# Altium schematic sheet F1C200S.SchDoc
size A2
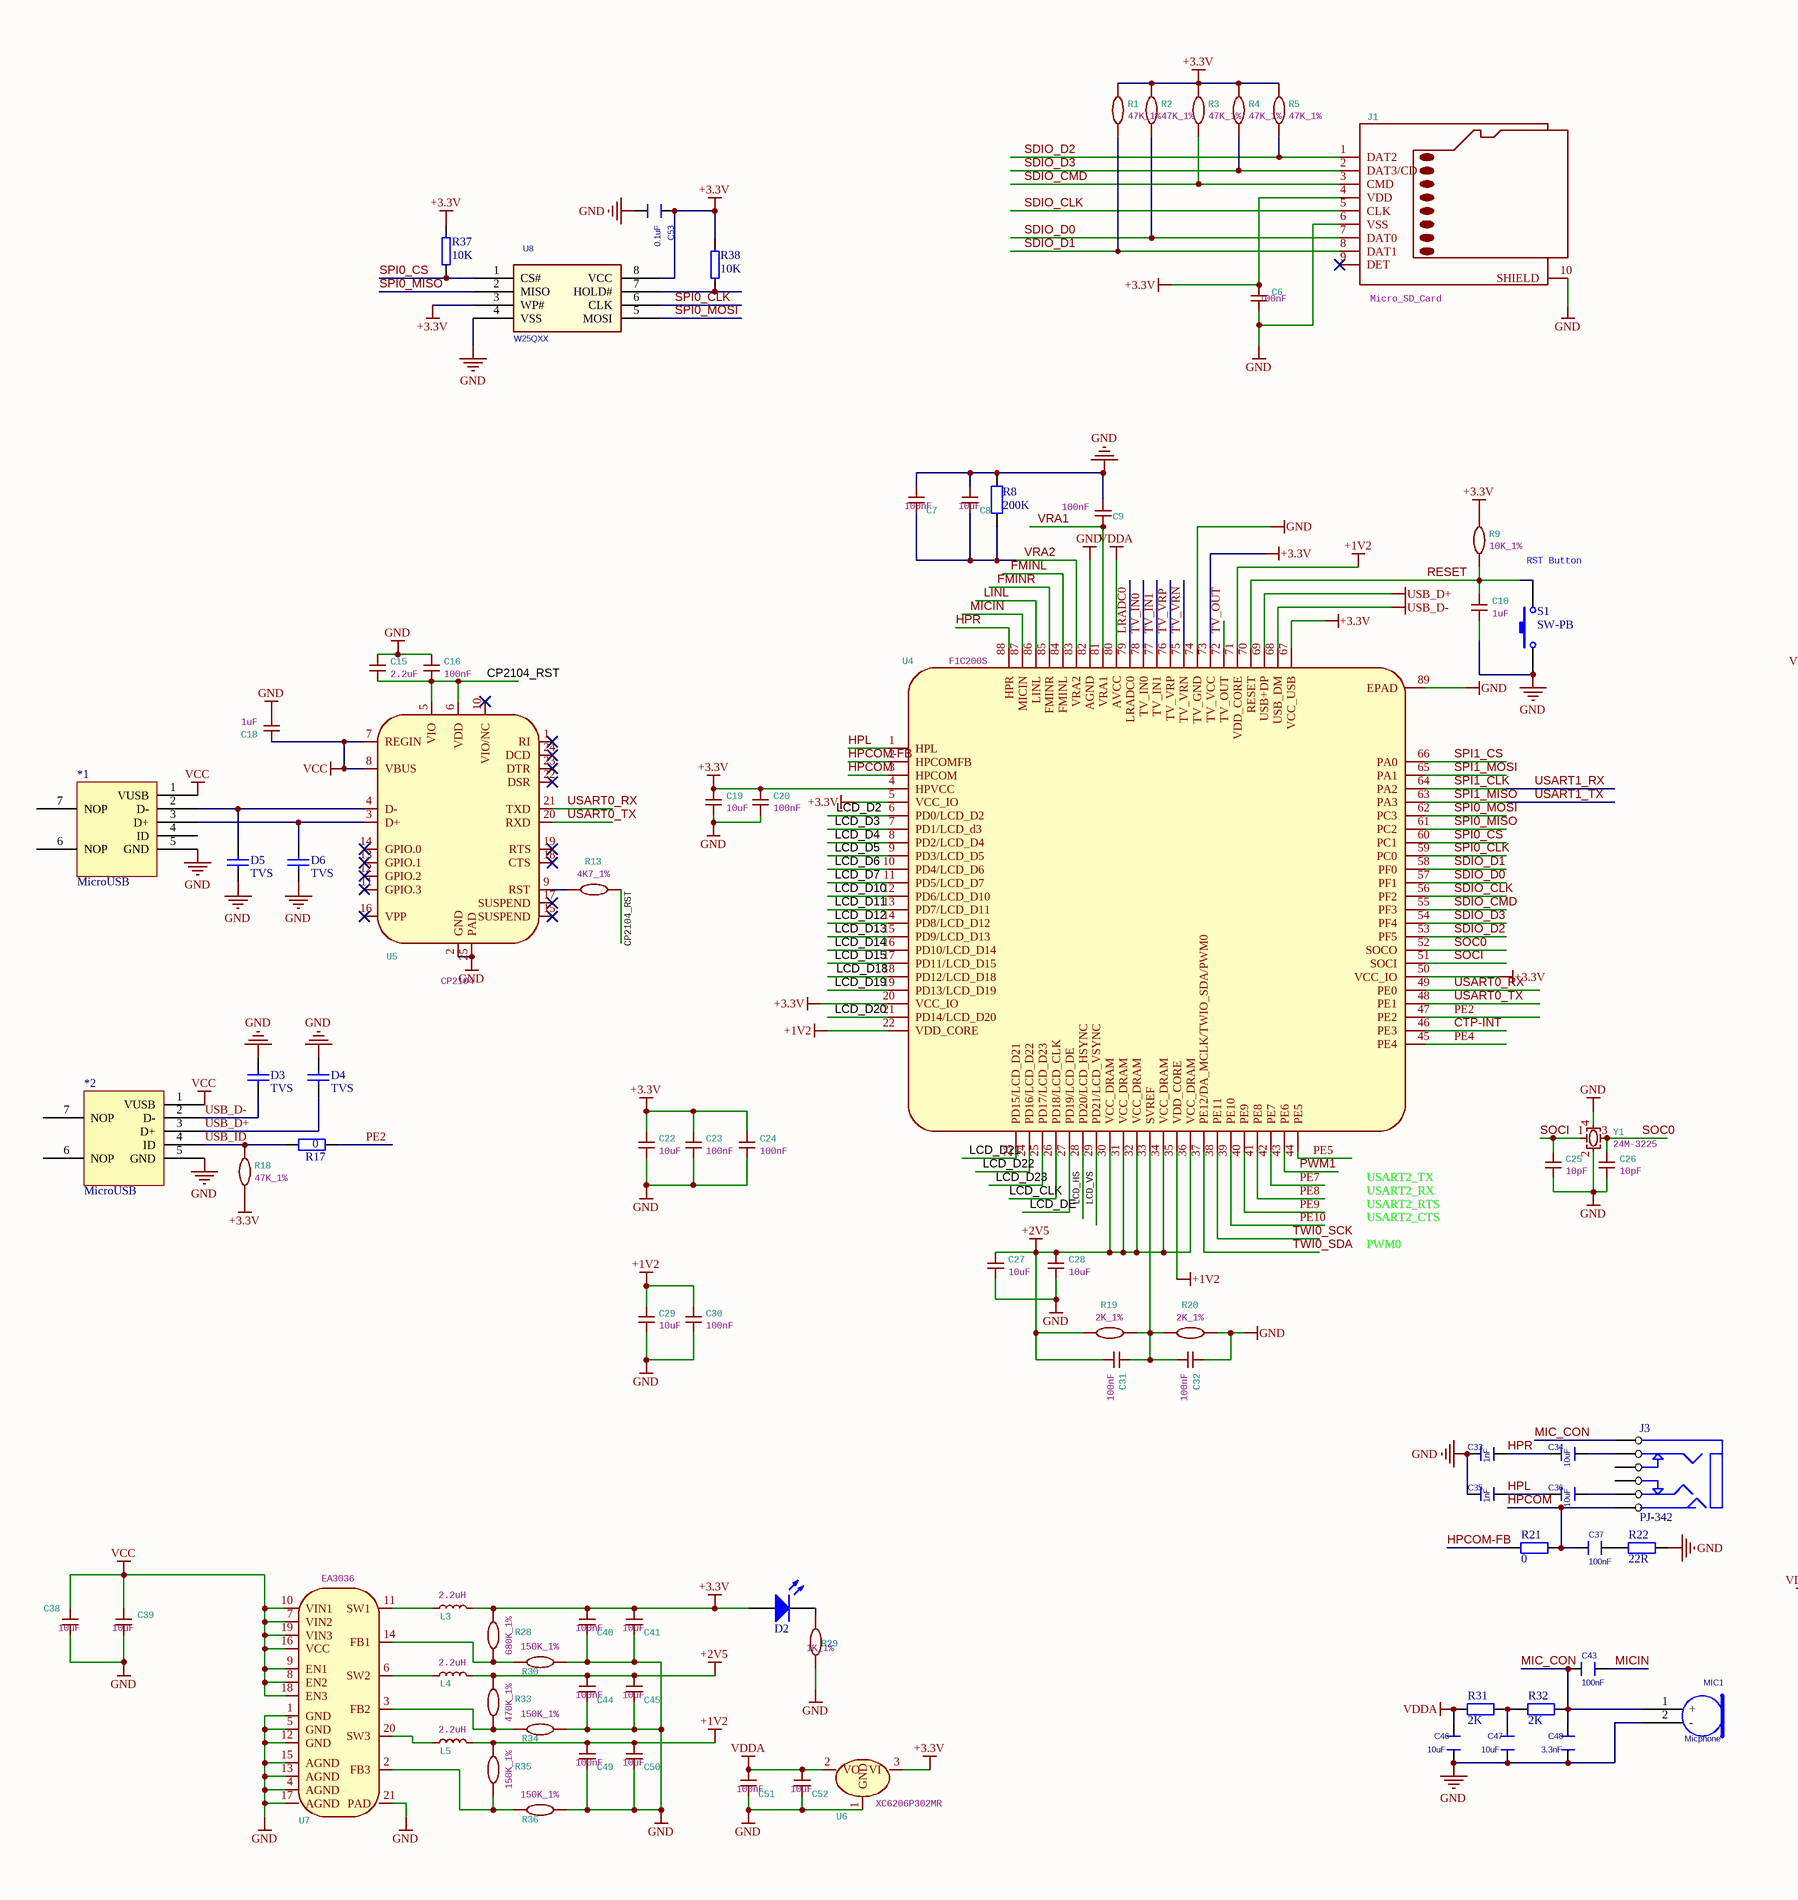
[diagram p0: F1C200S.SchDoc, left]
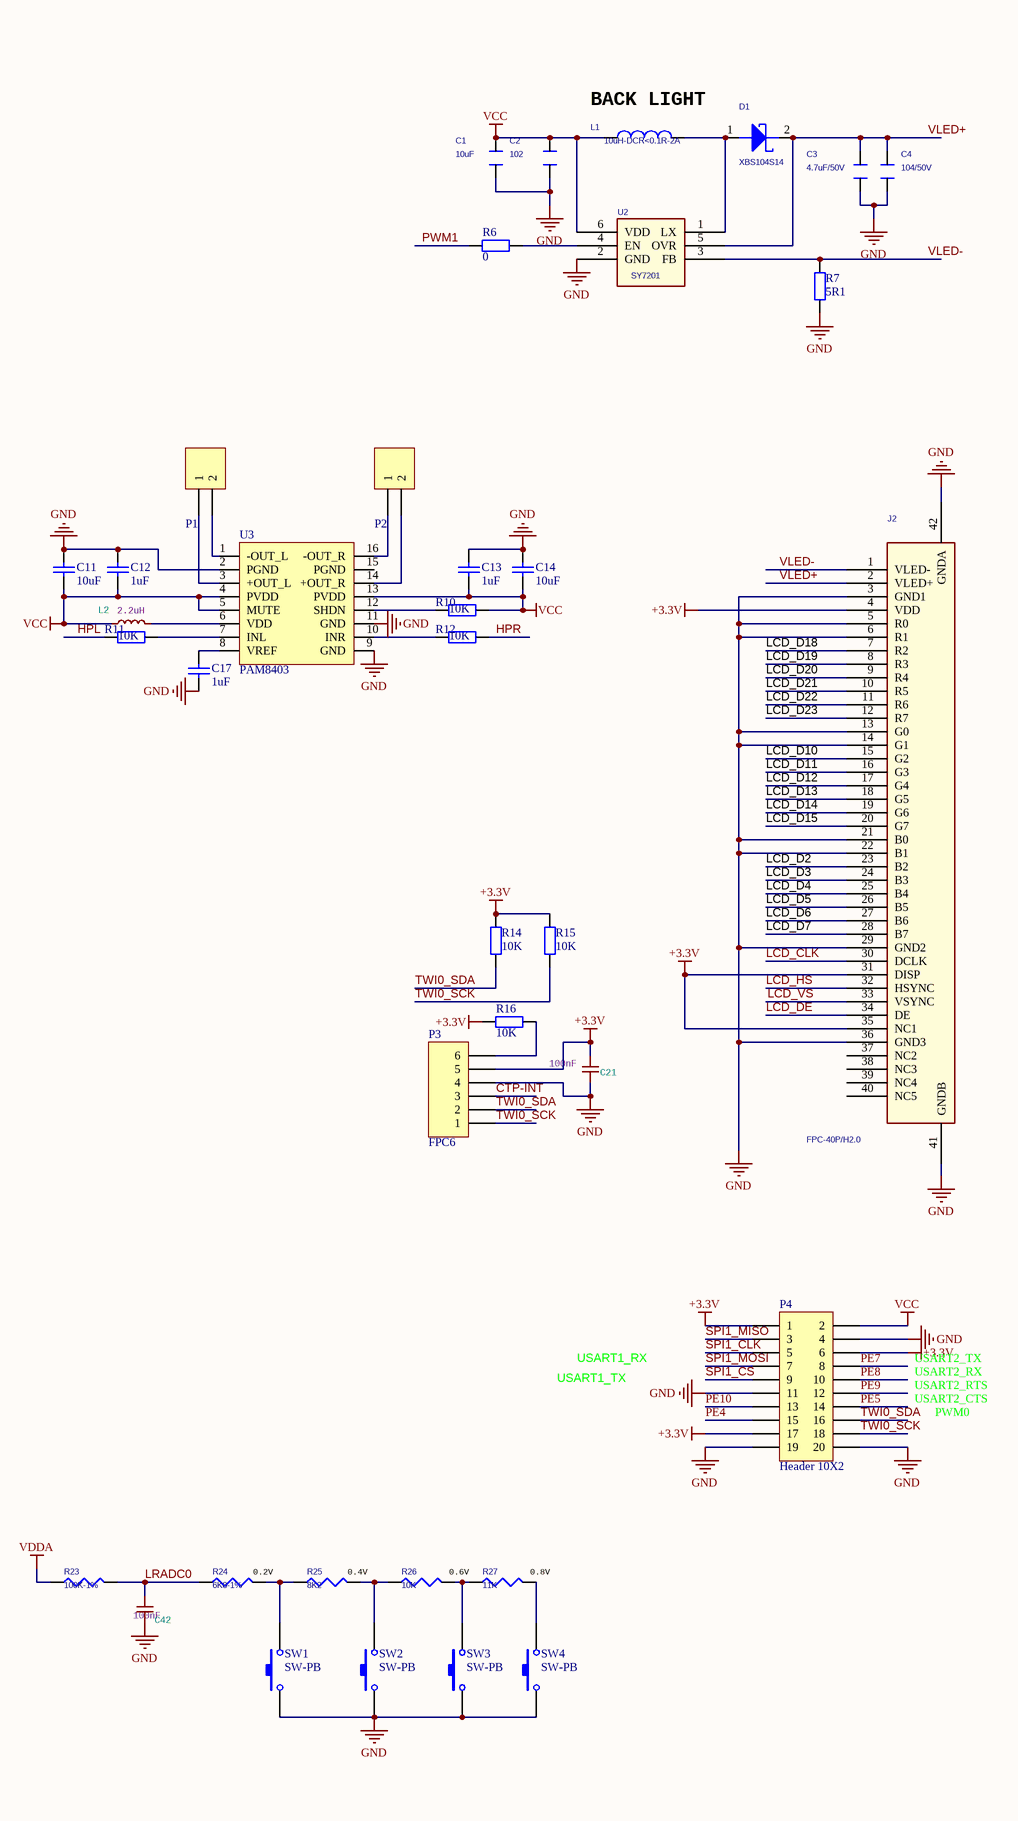
[diagram p1: F1C200S.SchDoc, right]

## Parts
*1  MicroUSB  [USB_Micro - 4FP]
*2  MicroUSB  [USB_Micro - 4FP]
C1  10uF  [C0603]
C2  102  [C0603]
C3  4.7uF/50V  [C0603]
C4  104/50V  [C0603]
C6  03.0009_C0402_100nF  [C0402]  (value not drawn)
C7  03.0009_C0402_100nF  [C0402]  (value not drawn)
C8  03.4004_C0603_10uF  [C0603]  (value not drawn)
C9  03.0009_C0402_100nF  [C0402]  (value not drawn)
C10  03.0001_C0402_1uF  [C0402]  (value not drawn)
C11  value 10uF  [C0603]  (hidden comment: Cap)
C12  value 1uF  [C0402]  (hidden comment: Cap)
C13  value 1uF  [C0402]  (hidden comment: Cap)
C14  value 10uF  [C0603]  (hidden comment: Cap)
C15  03.4002_C0603_2.2uF  [C0402]  (value not drawn)
C16  03.0009_C0402_100nF  [C0402]  (value not drawn)
C17  value 1uF  [C0402]  (hidden comment: Cap)
C18  03.4001_C0603_1uF  [C0402]  (value not drawn)
C19  03.4004_C0603_10uF  [C0603]  (value not drawn)
C20  03.0009_C0402_100nF  [C0402]  (value not drawn)
C21  03.0009_C0402_100nF  [C0402]  (value not drawn)
C22  03.4004_C0603_10uF  [C0603]  (value not drawn)
C23  03.0009_C0402_100nF  [C0402]  (value not drawn)
C24  03.0009_C0402_100nF  [C0402]  (value not drawn)
C25  03.0003_C0402_10pF  [C0402]  (value not drawn)
C26  03.0003_C0402_10pF  [C0402]  (value not drawn)
C27  03.4004_C0603_10uF  [C0603]  (value not drawn)
C28  03.4004_C0603_10uF  [C0603]  (value not drawn)
C29  03.4004_C0603_10uF  [C0603]  (value not drawn)
C30  03.0009_C0402_100nF  [C0402]  (value not drawn)
C31  03.0009_C0402_100nF  [C0402]  (value not drawn)
C32  03.0009_C0402_100nF  [C0402]  (value not drawn)
C33  1nF  [C0402]
C34  10uF  [C0603]
C35  1nF  [C0402]
C36  10uF  [C0603]
C37  100nF  [C0402]
C38  03.4004_C0603_10uF  [C0603]  (value not drawn)
C39  03.4004_C0603_10uF  [C0603]  (value not drawn)
C40  03.0009_C0402_100nF  [C0402]  (value not drawn)
C41  03.4004_C0603_10uF  [C0603]  (value not drawn)
C42  03.0009_C0402_100nF  [C0402]  (value not drawn)
C43  100nF  [C0402]
C44  03.0009_C0402_100nF  [C0402]  (value not drawn)
C45  03.4004_C0603_10uF  [C0603]  (value not drawn)
C46  10uF  [C0603]
C47  10uF  [C0603]
C48  3.3nF  [C0402]
C49  03.0009_C0402_100nF  [C0402]  (value not drawn)
C50  03.4004_C0603_10uF  [C0603]  (value not drawn)
C51  03.0009_C0402_100nF  [C0402]  (value not drawn)
C52  03.4004_C0603_10uF  [C0603]  (value not drawn)
C53  0.1uF  [C0402]
D1  XBS104S14  [SOD123]
D2  LED0  [0603LED]  (value not drawn)
D3  value TVS  [C0402]  (hidden comment: Cap)
D4  value TVS  [C0402]  (hidden comment: Cap)
D5  value TVS  [C0402]  (hidden comment: Cap)
D6  value TVS  [C0402]  (hidden comment: Cap)
J1  10.0001_Micro_SD_Card  [SDCARD-M]  (value not drawn)
J2  FPC-40P/H2.0  [FPC0.5-40P-B]
J3  PJ-342  [PJ-342]
L1  10uH-DCR<0.1R-2A  [3015]
L2  06.0102_L2520_2.2uH  [3015]  (value not drawn)
L3  06.0102_L2520_2.2uH  [3015]  (value not drawn)
L4  06.0102_L2520_2.2uH  [3015]  (value not drawn)
L5  06.0102_L2520_2.2uH  [3015]  (value not drawn)
MIC1  Micphone  [MIC_6022]
P1  Header 2  [HDR2X1_A]  (value not drawn)
P2  Header 2  [HDR2X1_A]  (value not drawn)
P3  FPC6  [FPC0.5-6P-A]
P4  Header 10X2  [HDR2X10]
R1  02.0014_R0402_10K_1%  [R0402]  (value not drawn)
R2  02.0014_R0402_10K_1%  [R0402]  (value not drawn)
R3  02.0014_R0402_10K_1%  [R0402]  (value not drawn)
R4  02.0014_R0402_10K_1%  [R0402]  (value not drawn)
R5  02.0014_R0402_10K_1%  [R0402]  (value not drawn)
R6  value 0  [R0402]  (hidden comment: Res1)
R7  value 5R1  [R0603]  (hidden comment: Res1)
R8  value 200K  [R0402]  (hidden comment: Res1)
R9  02.0008_R0402_10K_1%  [R0402]  (value not drawn)
R10  value 10K  [R0402]  (hidden comment: Res1)
R11  value 10K  [R0402]  (hidden comment: Res1)
R12  value 10K  [R0402]  (hidden comment: Res1)
R13  02.0005_R0402_4K7_1%  [R0402]  (value not drawn)
R14  value 10K  [R0402]  (hidden comment: Res1)
R15  value 10K  [R0402]  (hidden comment: Res1)
R16  value 10K  [R0402]  (hidden comment: Res1)
R17  value 0  [R0402]  (hidden comment: Res1)
R18  02.0014_R0402_10K_1%  [R0402]  (value not drawn)
R19  02.0026_R0402_2K_1%  [R0402]  (value not drawn)
R20  02.0026_R0402_2K_1%  [R0402]  (value not drawn)
R21  value 0  [R0402]  (hidden comment: Res1)
R22  value 22R  [R0603]  (hidden comment: Res1)
R23  100K-1%  [R0402]
R24  6K8-1%  [R0402]
R25  8K2  [R0402]
R26  10K  [R0402]
R27  11K  [R0402]
R28  02.0025_R0402_680K_1%  [R0402]  (value not drawn)
R29  02.0003_R0402_1K_1%  [R0402]  (value not drawn)
R30  02.0023_R0402_150K_1%  [R0402]  (value not drawn)
R31  value 2K  [R0402]  (hidden comment: Res1)
R32  value 2K  [R0402]  (hidden comment: Res1)
R33  02.0024_R0402_470K_1%  [R0402]  (value not drawn)
R34  02.0023_R0402_150K_1%  [R0402]  (value not drawn)
R35  02.0023_R0402_150K_1%  [R0402]  (value not drawn)
R36  02.0023_R0402_150K_1%  [R0402]  (value not drawn)
R37  10K  [R0402]
R38  10K  [R0402]
S1  SW-PB  [SW_PB4_3*4*2.5]
SW1  SW-PB  [SW_PB4_3*4*2.5]
SW2  SW-PB  [SW_PB4_3*4*2.5]
SW3  SW-PB  [SW_PB4_3*4*2.5]
SW4  SW-PB  [SW_PB4_3*4*2.5]
U2  SY7201  [SOT-23-6]
U3  PAM8403  [SOP-16]
U4  08.0001_F1C200S  [QFN-88_EP_10X10_PITCH0.4MM]  (value not drawn)
U5  09.0001_CP2104  [QFN-24-1EP_4X4MM_P0.5MM_EP2.6X2.6MM]  (value not drawn)
U6  09.0103_XC6206  [SOT-23]  (value not drawn)
U7  09.0102_EA3036  [QFN-20_EP_3X3_PITCH0.4MM]  (value not drawn)
U8  W25QXX  [SOP-8M(PAD)]
Y1  07.0403_Crystal_24M_3225  [CRYSTAL-2.5X2.0]  (value not drawn)

## Nets
+1V2: C29.1 C30.1 C49.1 C50.1 L5.1 R35.2 U4.22(VDD_CORE) U4.35(VDD_CORE) U4.71(VDD_CORE)
+2V5: C27.1 C28.1 C31.2 C44.1 C45.1 L4.1 R19.2 R33.2 U4.30(VCC_DRAM) U4.31(VCC_DRAM) U4.32(VCC_DRAM) U4.34(VCC_DRAM) U4.36(VCC_DRAM)
+3.3V: C6.1 C19.1 C20.1 C21.2 C22.1 C23.1 C24.1 C40.1 C41.1 C53.2 D2.1(A) J1.4(VDD) J2.4(VDD) J2.31(DISP) J2.35(NC1) L3.1 P3.5 P4.1 P4.6 P4.17 R1.1 R2.1 R3.1 R4.1 R5.1 R9.1 R14.2 R15.2 R16.2 R18.2 R28.2 R37.1 R38.1 U4.4(HPVCC) U4.5(VCC_IO) U4.20(VCC_IO) U4.50(VCC_IO) U4.67(VCC_USB) U4.73(TV_VCC) U6.3(VI) U8.3(WP#) U8.8(VCC)
GND: *1.5(GND) *2.5(GND) C1.1 C2.1 C3.1 C4.1 C6.2 C7.1 C8.1 C9.2 C10.2 C11.1 C12.1 C13.1 C14.1 C15.1 C16.1 C17.2 C18.2 C19.2 C20.2 C21.1 C22.2 C23.2 C24.2 C25.2 C26.2 C27.2 C28.2 C29.2 C30.2 C32.1 C33.1 C35.1 C38.2 C39.2 C40.2 C41.2 C42.2 C44.2 C45.2 C46.2 C47.2 C48.2 C49.2 C50.2 C51.2 C52.2 C53.1 D3.2 D4.2 D5.1 D6.1 J1.6(VSS) J1.10(SHIELD) J2.3(GND1) J2.5(R0) J2.6(R1) J2.13(G0) J2.14(G1) J2.21(B0) J2.22(B1) J2.29(GND2) J2.36(GND3) J2.41(GNDB) J2.42(GNDA) MIC1.2(-) P3.4 P4.4 P4.11 P4.19 P4.20 R7.2 R8.2 R20.1 R22.1 R29.2 R30.1 R34.1 R36.1 S1.1 SW1.1 SW2.1 SW3.1 SW4.1 U2.2(GND) U3.2(PGND) U3.9(GND) U3.11(GND) U4.74(TV_GND) U4.82(AGND) U4.89(EPAD) U5.2(GND) U5.25(PAD) U6.1(GND) U7.1(GND) U7.4(AGND) U7.5(GND) U7.12(GND) U7.13(AGND) U7.15(AGND) U7.17(AGND) U7.21(PAD) U8.4(VSS) Y1.2 Y1.4
USB_D+: *2.3(D+) D4.1 U4.69(USB+DP)
USB_D-: *2.2(D-) D3.1 U4.68(USB_DM)
VCC: *1.1(VUSB) *2.1(VUSB) C1.2 C2.2 C11.2 C12.2 C13.2 C14.2 C18.1 C38.1 C39.1 L1.1 L2.2 P4.2 R10.2 U2.6(VDD) U3.4(PVDD) U3.5(MUTE) U3.13(PVDD) U5.7(REGIN) U5.8(VBUS) U7.7(VIN2) U7.8(EN2) U7.9(EN1) U7.10(VIN1) U7.16(VCC) U7.18(EN3) U7.19(VIN3)
VDDA: C46.1 C51.1 C52.1 R23.1 R31.2 U4.80(AVCC) U6.2(VO)
CP2104_RST: C15.2 C16.2 R13.2 U5.5(VIO) U5.6(VDD)
CTP-INT: P3.3 U4.46(PE3)
FMINL: U4.84(FMINL)
FMINR: U4.85(FMINR)
HPCOM: C37.2 J3.3(GND) R21.1 U4.3(HPCOM)
HPCOM-FB: R21.2 U4.2(HPCOMFB)
HPL: C35.2 C36.1 R11.2 U4.1(HPL)
HPR: C33.2 C34.1 R12.2 U4.88(HPR)
LCD_CLK: J2.30(DCLK) U4.26(PD18/LCD_CLK)
LCD_D2: J2.23(B2) U4.6(PD0/LCD_D2)
LCD_D3: J2.24(B3) U4.7(PD1/LCD_d3)
LCD_D4: J2.25(B4) U4.8(PD2/LCD_D4)
LCD_D5: J2.26(B5) U4.9(PD3/LCD_D5)
LCD_D6: J2.27(B6) U4.10(PD4/LCD_D6)
LCD_D7: J2.28(B7) U4.11(PD5/LCD_D7)
LCD_D10: J2.15(G2) U4.12(PD6/LCD_D10)
LCD_D11: J2.16(G3) U4.13(PD7/LCD_D11)
LCD_D12: J2.17(G4) U4.14(PD8/LCD_D12)
LCD_D13: J2.18(G5) U4.15(PD9/LCD_D13)
LCD_D14: J2.19(G6) U4.16(PD10/LCD_D14)
LCD_D15: J2.20(G7) U4.17(PD11/LCD_D15)
LCD_D18: J2.7(R2) U4.18(PD12/LCD_D18)
LCD_D19: J2.8(R3) U4.19(PD13/LCD_D19)
LCD_D20: J2.9(R4) U4.21(PD14/LCD_D20)
LCD_D21: J2.10(R5) U4.23(PD15/LCD_D21)
LCD_D22: J2.11(R6) U4.24(PD16/LCD_D22)
LCD_D23: J2.12(R7) U4.25(PD17/LCD_D23)
LCD_DE: J2.34(DE) U4.27(PD19/LCD_DE)
LCD_HS: J2.32(HSYNC) U4.28(PD20/LCD_HSYNC)
LCD_VS: J2.33(VSYNC) U4.29(PD21/LCD_VSYNC)
LINL: U4.86(LINL)
LRADC0: C42.1 R23.2 R24.1 U4.79(LRADC0)
MIC_CON: C43.2 C48.1 J3.2(MIC) MIC1.1(+) R32.1
MICIN: C43.1 U4.87(MICIN)
PE2: R17.2 U4.47(PE2)
PE4: P4.15 U4.45(PE4)
PE5: P4.14 U4.44(PE5)
PE7: P4.8 U4.42(PE7)
PE8: P4.10 U4.41(PE8)
PE9: P4.12 U4.40(PE9)
PE10: P4.13 U4.39(PE10)
PWM1: R6.1 U4.43(PE6)
RESET: C10.1 R9.2 S1.2 U4.70(RESET)
SDIO_CLK: J1.5(CLK) U4.56(PF2)
SDIO_CMD: J1.3(CMD) R3.2 U4.55(PF3)
SDIO_D0: J1.7(DAT0) R2.2 U4.57(PF1)
SDIO_D1: J1.8(DAT1) R1.2 U4.58(PF0)
SDIO_D2: J1.1(DAT2) R5.2 U4.53(PF5)
SDIO_D3: J1.2(DAT3/CD) R4.2 U4.54(PF4)
SOC0: C26.1 U4.52(SOCO) Y1.3
SOCI: C25.1 U4.51(SOCI) Y1.1
SPI0_CLK: U4.59(PC0) U8.6(CLK)
SPI0_CS: R37.2 U4.60(PC1) U8.1(CS#)
SPI0_MISO: U4.61(PC2) U8.2(MISO)
SPI0_MOSI: U4.62(PC3) U8.5(MOSI)
SPI1_CLK: P4.5 U4.64(PA2)  [also labelled USART1_RX]
SPI1_CS: P4.9 U4.66(PA0)
SPI1_MISO: P4.3 U4.63(PA3)  [also labelled USART1_TX]
SPI1_MOSI: P4.7 U4.65(PA1)
TV_IN0: U4.78(TV_IN0)
TV_IN1: U4.77(TV_IN1)
TV_OUT: U4.72(TV_OUT)
TV_VRN: U4.75(TV_VRN)
TV_VRP: U4.76(TV_VRP)
TWI0_SCK: P3.1 P4.18 R15.1 U4.38(PE11)
TWI0_SDA: P3.2 P4.16 R14.1 U4.37(PE12/DA_MCLK/TWIO_SDA/PWM0)
USART0_RX: U4.49(PE0) U5.21(TXD)
USART0_TX: U4.48(PE1) U5.20(RXD)
USB_ID: *2.4(ID) R17.1 R18.1
VLED+: C3.2 C4.2 D1.2 J2.2(VLED+) U2.5(OVR)
VLED-: J2.1(VLED-) R7.1 U2.3(FB)
VRA1: C9.1 U4.81(VRA1)
VRA2: C7.2 C8.2 R8.1 U4.83(VRA2)
Net*1_2: *1.2(D-) D5.2 U5.4(D-)
Net*1_3: *1.3(D+) D6.2 U5.3(D+)
NetC17_1: C17.1 U3.8(VREF)
NetC31_1: C31.1 C32.2 R19.1 R20.2 U4.33(SVREF)
NetC34_2: C34.2 J3.4(R)
NetC36_2: C36.2 J3.6(L)
NetC37_1: C37.1 R22.2
NetC47_1: C47.1 R31.1 R32.2
NetD1_1: D1.1 L1.2 U2.1(LX)
NetD2_2: D2.2(K) R29.1
NetL2_1: L2.1 U3.6(VDD)
NetL3_2: L3.2 U7.11(SW1)
NetL4_2: L4.2 U7.6(SW2)
NetL5_2: L5.2 U7.20(SW3)
NetP1_1: P1.1 U3.3(+OUT_L)
NetP1_2: P1.2 U3.1(-OUT_L)
NetP2_1: P2.1 U3.16(-OUT_R)
NetP2_2: P2.2 U3.14(+OUT_R)
NetP3_6: P3.6 R16.1
NetR6_2: R6.2 U2.4(EN)
NetR10_1: R10.1 U3.12(SHDN)
NetR11_1: R11.1 U3.7(INL)
NetR12_1: R12.1 U3.10(INR)
NetR13_1: R13.1 U5.9(RST)
NetR24_2: R24.2 R25.1 SW1.2
NetR25_2: R25.2 R26.1 SW2.2
NetR26_2: R26.2 R27.1 SW3.2
NetR27_2: R27.2 SW4.2
NetR28_1: R28.1 R30.2 U7.14(FB1)
NetR33_1: R33.1 R34.2 U7.3(FB2)
NetR35_1: R35.1 R36.2 U7.2(FB3)
NetR38_2: R38.2 U8.7(HOLD#)

Not connected (* = marked no-connect by the designer): *1 4(ID) 6(NOP) 7(NOP); *2 6(NOP) 7(NOP); J1 9(DET)*; J2 37(NC2) 38(NC3) 39(NC4) 40(NC5); J3 5(R_DET) 7(L_DET); U3 15(PGND); U5 1(RI)* 10(VIO/NC)* 11(GPIO.3)* 12(GPIO.2)* 13(GPIO.1)* 14(GPIO.0)* 15(SUSPEND)* 16(VPP)* 17(SUSPEND)* 18(CTS)* 19(RTS)* 22(DSR)* 23(DTR)* 24(DCD)*

## Notes on the sheet
- (near L1) BACK LIGHT
- RST Button
- (near R24) 0.2V
- (near R25) 0.4V
- (near R26) 0.6V
- (near R27) 0.8V
- Labels drawn without touching a wire or pin: PWM0, USART1_RX, USART1_TX, USART2_CTS, USART2_RTS, USART2_RX, USART2_TX

## Library data of the parts
C1 C2 = CAPACITOR_0_Dup5: PAGE: 2; mypage: 09
C3 C4 = CAPACITOR_0_Dup5: mypage: 09; PAGE: 2
C6 C7 C9 C16 C20 C21 C23 C24 C30-C32 C40 C42 C44 C49 C51 = 03.0009_C0402_100nF: 分类: 贴片瓷片电容; 规格: 100nF,16V,K,0402,X7R; 参数: 100nF; 编码: 03.0009
C8 C19 C22 C27-C29 C38 C39 C41 C45 C50 C52 = 03.4004_C0603_10uF: 分类: 贴片瓷片电容; 规格: 10uF,16V,K,0603,X5R; 参数: 10uF; 编码: 03.4004
C10 = 03.0001_C0402_1uF: 分类: 贴片瓷片电容; 规格: 1uF,10V,K,X5R; 参数: 1uF; 编码: 03.0001
C11-C14 C17 D3-D6 = Cap: 无极性电容; Published: 8-Jun-2000; LatestRevisionDate: 17-Jul-2002; LatestRevisionNote: Re-released for DXP Platform.; PackageReference: RAD-0.3; Publisher: Altium Limited
C15 = 03.4002_C0603_2.2uF: 分类: 贴片瓷片电容; 规格: 2.2uF,16V,K,X5R; 参数: 2.2uF; 编码: 03.4002
C18 = 03.4001_C0603_1uF: 分类: 贴片瓷片电容; 规格: 1uF,16V,K,0603,,X7R; 参数: 1uF; 编码: 03.4001
C25 C26 = 03.0003_C0402_10pF: 分类: 贴片瓷片电容; 规格: 10PF,50V,J,0402,NPO(C0G); 参数: 10pF; 编码: 03.0003
C33-C37 C43 C46-C48 = CAPACITOR_Dup3: PAGE: 2; mypage: 13
C53 = CAPACITOR_Dup1: PAGE: 7
D1 = DIODE SCHOTTKY_0: RoHS 1.0 Ampere Schottky Barrier Rectifiers  SOD-123
D2 = LED0: 发光二极管; Published: 8-Jun-2000; LatestRevisionDate: 08-Jul-2005; LatestRevisionNote: Mech Layer 1 removed.; PackageReference: LED-0; Publisher: Altium Limited
J1 = 10.0001_Micro_SD_Card: 规格: TF卡座，9PIN, 自弹，带定位脚，韩荣TF-01A; 分类: 接插件; Datasheet: https://item.szlcsc.com/92334.html; 参数: Micro_SD_Card; 编码: 10.0001
J2 = LCD-LW500AC9001_0
L1 = INDUCTOR_3: RoHS Power Inductor 22uH 300mA H<1.8MM,CD32; mypage: 09
L2-L5 = 06.0102_L2520_2.2uH: 分类: 贴片功率电感; 规格: 2.2uH, SMD,2.5x2x1mm,顺络; 参数: 2.2uH; 编码: 06.0102
MIC1 = Micphone_0: mypage: 13
P1 P2 = Header 2: 接插件; LatestRevisionDate: 17-Jul-2002; LatestRevisionNote: Re-released for DXP Platform.; Publisher: Altium Limited
P3 = Header 6: 接插件; LatestRevisionDate: 17-Jul-2002; LatestRevisionNote: Re-released for DXP Platform.; Publisher: Altium Limited
P4 = Header 10X2: Header, 10-Pin, Dual row; LatestRevisionDate: 17-Jul-2002; LatestRevisionNote: Re-released for DXP Platform.; Publisher: Altium Limited
R1-R5 R18 = 02.0014_R0402_47K_1%: 分类: 贴片电阻; 规格: 贴片电阻, 10K±1%, 0402; 参数: 47K_1%; 编码: 02.0014
R6-R8 R10-R12 R14-R17 R21 R22 R31 R32 = Res1: 贴片电阻; Published: 8-Jun-2000; LatestRevisionDate: 17-Jul-2002; LatestRevisionNote: Re-released for DXP Platform.; PackageReference: AXIAL-0.4; Publisher: Altium Limited
R9 = 02.0008_R0402_10K_1%: 分类: 贴片电阻; 规格: 贴片电阻, 10K±1%, 0402; 参数: 10K_1%; 编码: 02.0008
R13 = 02.0005_R0402_4K7_1%: 分类: 贴片电阻; 规格: 贴片电阻, 4K7±1%, 0402; 参数: 4K7_1%; 编码: 02.0005
R19 R20 = 02.0026_R0402_2K_1%: 分类: 贴片电阻; 规格: 贴片电阻, 2K±1%, 0402; 参数: 2K_1%; 编码: 02.0026
R23-R27 = R1 0805_Dup1
R28 = 02.0025_R0402_680K_1%: 分类: 贴片电阻; 规格: 贴片电阻, 680K±1%, 0402; 编码: 02.0025; 参数: 680K_1%
R29 = 02.0003_R0402_1K_1%: 分类: 贴片电阻; 规格: 贴片电阻, 1K±1%, 0402; 参数: 1K_1%; 编码: 02.0003
R30 R34-R36 = 02.0023_R0402_150K_1%: 分类: 贴片电阻; 规格: 贴片电阻, 150K±1%, 0402; 编码: 02.0023; 参数: 150K_1%
R33 = 02.0024_R0402_470K_1%: 分类: 贴片电阻; 规格: 贴片电阻, 470K±1%, 0402; 编码: 02.0024; 参数: 470K_1%
R37 R38 = 电阻Ω: Resistor
S1 SW1-SW4 = SW-PB: 微动开关; Published: 24-Mar-1999; LatestRevisionDate: 17-Jul-2002; LatestRevisionNote: Re-released for DXP Platform.; PackageReference: SPST-2; Publisher: Altium Limited
U2 = AP3031
U4 = 08.0001_F1C200S: 分类: CPU; 规格: F1C200S， QFN88,10X10, 64M RAM; 编码: 08.0001; 参数: F1C200S
U5 = 09.0001_CP2104: 分类: IC; 规格: CP2014 USB转串口芯片; 参数: CP2104; Datasheet: https://www.silabs.com/documents/public/data-sheets/cp2104.pdf; 编码: 09.0001
U6 = 09.0103_XC6206: 分类: LDO; 规格: XC6206P302MR, 3.0V，250mA，12VinMax; 参数: XC6206P302MR; Datasheet: https://item.szlcsc.com/10507.html; 编码: 09.0103
U7 = 09.0102_EA3036: 分类: LDO; 规格: EA3036; 编码: 09.0102; 参数: EA3036
U8 = SPI-NOR-SO8: PAGE: 7
Y1 = 07.0403_Crystal_24M_3225: 分类: 晶振; 规格: YXC 24MHz±20ppm,20PF, 3.2X2.5; 参数: 24M-3225; 编码: 07.0403